# EAGLE design cpu-card-atmega328 (EAGLE 7.6.0)
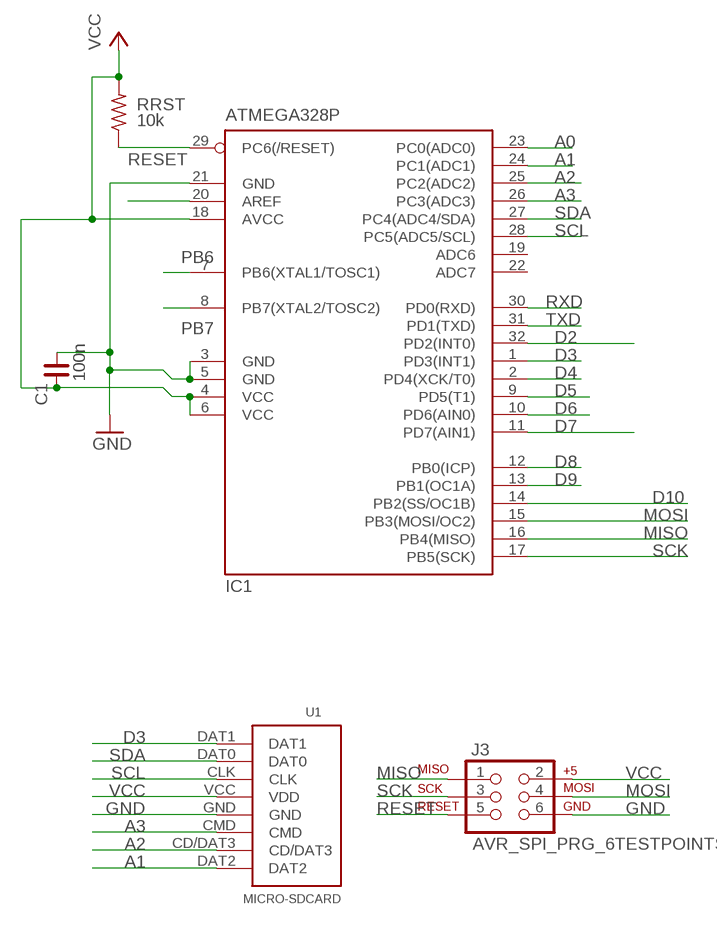
[diagram p0: schematic, sheet 1]

## Parts
C1  100n  C_0603  [C0603]
IC1  ATMEGA328P  MEGA8-AI  [TQFP32-08]
J3  AVR_SPI_PRG_6TESTPOINTS  [2X3_TEST_POINTS]
RRST  10k  R-US_R0603  [R0603@1]
U1  MICRO-SDCARD  [MICRO-SDCARD]

## Nets
A0: IC1.23(PC0(ADC0))
A1: IC1.24(PC1(ADC1)) U1.DAT2
A2: IC1.25(PC2(ADC2)) U1.CD/DAT3
A3: IC1.26(PC3(ADC3)) U1.CMD
AREF: IC1.20(AREF)
D2: IC1.32(PD2(INT0))
D3: IC1.1(PD3(INT1)) U1.DAT1
D4: IC1.2(PD4(XCK/T0))
D5: IC1.9(PD5(T1))
D6: IC1.10(PD6(AIN0))
D7: IC1.11(PD7(AIN1))
D8: IC1.12(PB0(ICP))
D9: IC1.13(PB1(OC1A))
D10: IC1.14(PB2(SS/OC1B))
GND: C1.1 IC1.3(GND) IC1.5(GND) IC1.21(GND) J3.6 U1.GND
MISO: IC1.16(PB4(MISO)) J3.1
MOSI: IC1.15(PB3(MOSI/OC2)) J3.4
PB6: IC1.7(PB6(XTAL1/TOSC1))
PB7: IC1.8(PB7(XTAL2/TOSC2))
RESET: IC1.29(PC6(/RESET)) J3.5 RRST.1
RXD: IC1.30(PD0(RXD))
SCK: IC1.17(PB5(SCK)) J3.3
SCL: IC1.28(PC5(ADC5/SCL)) U1.CLK
SDA: IC1.27(PC4(ADC4/SDA)) U1.DAT0
TXD: IC1.31(PD1(TXD))
VCC: C1.2 IC1.4(VCC) IC1.6(VCC) IC1.18(AVCC) J3.2 RRST.2 U1.VCC(VDD)
Unconnected: IC1.19(ADC6) IC1.22(ADC7)

## Library data of the parts
C1 = rc-master-smd:C_: NON-POLARIZED CAP
IC1 = atmel:MEGA8: MICROCONTROLLER 8 Kbytes FLASH, 1 kbytes SRAM, 512 bytes EEPROM, USART, 6-channel 10 bit ADC, 2-channel 8 bit ADC Pin compatible with Atmega48, ATMega88, ATMega168 Source: avr.lbr; MPN: ATMEGA8-16AU; OC_FARNELL: 9171371; OC_NEWARK: 73M8863
J3 = SparkFun-Connectors:AVR_SPI_PRG_6: AVR ISP 6 Pin This is the reduced ISP connector for AVR programming. Common on Arduino. This footprint will take up less PCB space and can be used with a 10-pin to 6-pin adapter such as SKU: BOB-08508 **Special note about "TEST_POINT" package. The stop mask is on the top side, so if you want your programming test points to be on the bottom of your board, make sure to place this package on the bottom side of the board. This also ensure that the orientation to program from the bottom side will be correct.
RRST = rcl:R-US_: RESISTOR, American symbol
U1 = SparkFun:MICRO-SDCARD

## Net classes
0 default: width 0.203 mm, drill 0.356 mm, clearance 0.203 mm
1 GND: width 0.203 mm, drill 0.356 mm, clearance 0.203 mm

## Board
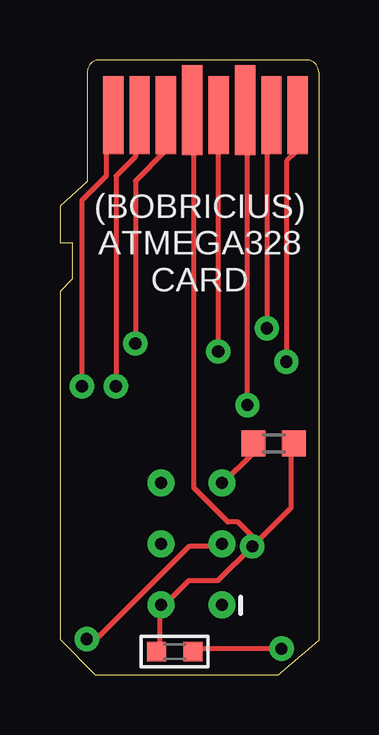
[diagram p1: board, top side]
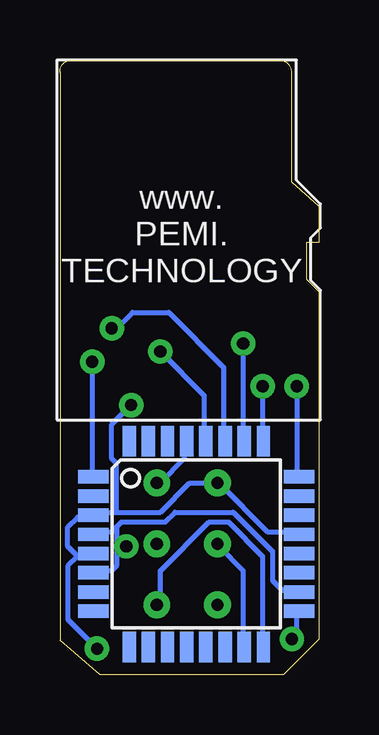
[diagram p2: board, bottom side, seen from below]

Size 10.79 x 25.63 mm. Coordinates in mm from the lower left corner, seen from the top.
Outline: 1.14,25.12 1.14,20.55 0,19.53 0,18.01 0.51,18.01 0.51,16.48 0,15.98 0,1.47 1.47,0 9.12,0 10.8,1.44 10.8,25.12 arc90 10.29,25.63 1.65,25.63 arc90 1.14,25.12
Copper layers (1*16): Top 0.035mm / dielectric 1.5mm / Bottom 0.035mm
Design rules "SparkFun": minimum track width 8mil, minimum drill 20mil, track to track 8mil, track to pad 8mil, pad to pad 8mil, via to via 8mil, smd to smd 8mil, copper to edge 9mil, drill to drill 8mil, minimum pad ring 12mil, minimum via ring 10mil, stop-mask expansion 4mil, vias tented up to drill 20mil, thermal gap 10mil
vRestrict: area 21.4,14.8 to 33.9,30.3

### Footprints (pad centres in the part's own frame; a part is rotated, then mirrored left to right if it is on the bottom)
C0603 = smd 0.8 x 0.8: 1 -0.762,0; 2 0.762,0
TQFP32-08 = smd 1.27 x 0.559: 1 -4.293,2.8; 2 -4.293,2; 3 -4.293,1.2; 4 -4.293,0.4; 5 -4.293,-0.4; 6 -4.293,-1.2; 7 -4.293,-2; 8 -4.293,-2.8; 17 4.293,-2.8; 18 4.293,-2; 19 4.293,-1.2; 20 4.293,-0.4; 21 4.293,0.4; 22 4.293,1.2; 23 4.293,2; 24 4.293,2.8 | smd 0.559 x 1.27: 9 -2.8,-4.293; 10 -2,-4.293; 11 -1.2,-4.293; 12 -0.4,-4.293; 13 0.4,-4.293; 14 1.2,-4.293; 15 2,-4.293; 16 2.8,-4.293; 25 2.8,4.293; 26 2,4.293; 27 1.2,4.293; 28 0.4,4.293; 29 -0.4,4.293; 30 -1.2,4.293; 31 -2,4.293; 32 -2.8,4.293
2X3_TEST_POINTS = drill 0.508: 1 -2.54,-1.27; 2 -2.54,1.27; 3 0,-1.27; 4 0,1.27; 5 2.54,-1.27; 6 2.54,1.27
R0603@1 = smd 1 x 1.1: 1 -0.85,0; 2 0.85,0
MICRO-SDCARD = smd 0.85 x 3.25 bottom: CD/DAT3 2.56,2.3; CLK 5.86,2.3; CMD 3.66,2.3; DAT0 8.06,2.3; DAT1 9.16,2.3; DAT2 1.46,2.3 | smd 0.85 x 3.75 bottom: GND 6.96,2.1; VCC 4.76,2.1

### Placement (x,y rotation side)
C1  4.79,0.97 180 top
IC1  5.11,5.45 0 bottom
J3  5.49,5.45 90 top
RRST  8.92,9.64 0 top
U1  0.76,25.63 180 bottom

### Tracks (layer width: path | path; a pad name or v marks a point on that pad's centre or on a via)
A1  (via drill 0.51)
  Top 0.203: v0.91,12.03 0.91,19.77 1.93,20.79 1.93,23.03 2.13,23.23 U1.DAT2
  Bottom 0.203: v0.91,12.03 0.91,8.39 IC1.24
A2  (via drill 0.51)
  Top 0.203: v2.34,12.03 2.34,20.79 3.15,21.6 3.15,23.23 U1.CD/DAT3
  Bottom 0.203: v2.34,12.03 2.34,9.82 IC1.25
A3  (via drill 0.51)
  Top 0.203: v3.15,13.81 3.15,20.59 4.37,21.81 4.37,23.23 U1.CMD
  Bottom 0.203: v3.15,13.81 3.15,9.82 IC1.26
D3  (via drill 0.51)
  Top 0.203: v9.45,13.04 9.45,21.4 9.86,21.81 9.86,23.23 U1.DAT1
  Bottom 0.203: v9.45,13.04 9.45,8.39 IC1.1
GND  (via drill 0.51)
  Top 0.203: v9.25,1.08 5.59,1.08 C1.1 | v7.82,11.24 7.82,23.43 U1.GND
  Bottom 0.203: IC1.21 0.91,5.96 2.13,5.96 4.17,7.99 J3.6 5.38,7.99 6.6,6.77 8.43,6.77 | v9.25,1.08 10.46,2.3 10.46,4.53 10.06,4.94 | 10.06,4.94 9.45,4.94 IC1.5 | 10.06,4.94 10.46,5.35 10.46,6.16 10.06,6.57 9.45,6.57 IC1.3 9.25,6.77 8.43,6.77 | v7.82,11.24 8.64,10.43 8.64,9 8.43,8.8 8.43,6.77
MISO
  Bottom 0.203: IC1.16 2.34,1.28 2.34,4.94 3.76,6.36 4.57,6.36 6.6,4.33 6.6,2.91 J3.1
MOSI
  Bottom 0.203: IC1.15 3.15,1.28 3.15,4.33 4.17,5.35 J3.4
RESET
  Top 0.203: RRST.1 8.03,9.61 8.03,9.21 6.81,7.99 J3.5
  Bottom 0.203: IC1.29 5.59,9.61 5.59,9 6.6,7.99 J3.5
SCK  (via drill 0.51)
  Top 0.203: v1.12,1.49 1.52,1.49 5.38,5.35 6.6,5.35 J3.3
  Bottom 0.203: v1.12,1.49 0.91,1.69 0.91,2.5 IC1.17
SCL  (via drill 0.51)
  Top 0.203: v6.6,13.47 6.6,23.23 U1.CLK
  Bottom 0.203: v6.6,13.47 4.78,11.65 4.78,9.82 IC1.28
SDA  (via drill 0.51)
  Top 0.203: v8.64,14.44 8.64,23.23 U1.DAT0
  Bottom 0.203: v8.64,14.44 8.64,14.24 7.77,15.1 6.25,15.1 3.96,12.81 3.96,9.82 IC1.27
VCC  (via drill 0.51)
  Top 0.203: C1.2 4.17,1.08 4.17,2.91 J3.2 4.37,2.91 5.38,3.92 6.6,3.92 v8.03,5.35 8.23,5.55 | 8.23,5.55 9.65,6.97 9.65,9.61 RRST.2 | 8.23,5.55 7.42,6.36 7.01,6.36 5.59,7.79 5.59,23.43 U1.VCC
  Bottom 0.203: 8.43,6.16 8.64,5.96 9.25,5.96 IC1.4 | 8.43,6.16 8.23,6.36 6.4,6.36 5.99,6.77 3.56,6.77 1.93,5.14 1.93,3.92 1.52,3.52 0.91,3.52 IC1.18 | 8.43,6.16 8.43,5.35 | 8.43,5.35 8.43,4.53 8.64,4.33 9.25,4.33 IC1.6 | v8.03,5.35 8.43,5.35

### Text on the board
tNames: (BOBRICIUS) / ATMEGA328 / CARD
bNames: www. / PEMI. / TECHNOLOGY